# EAGLE design Simon_Tilts (EAGLE 6.5.0)
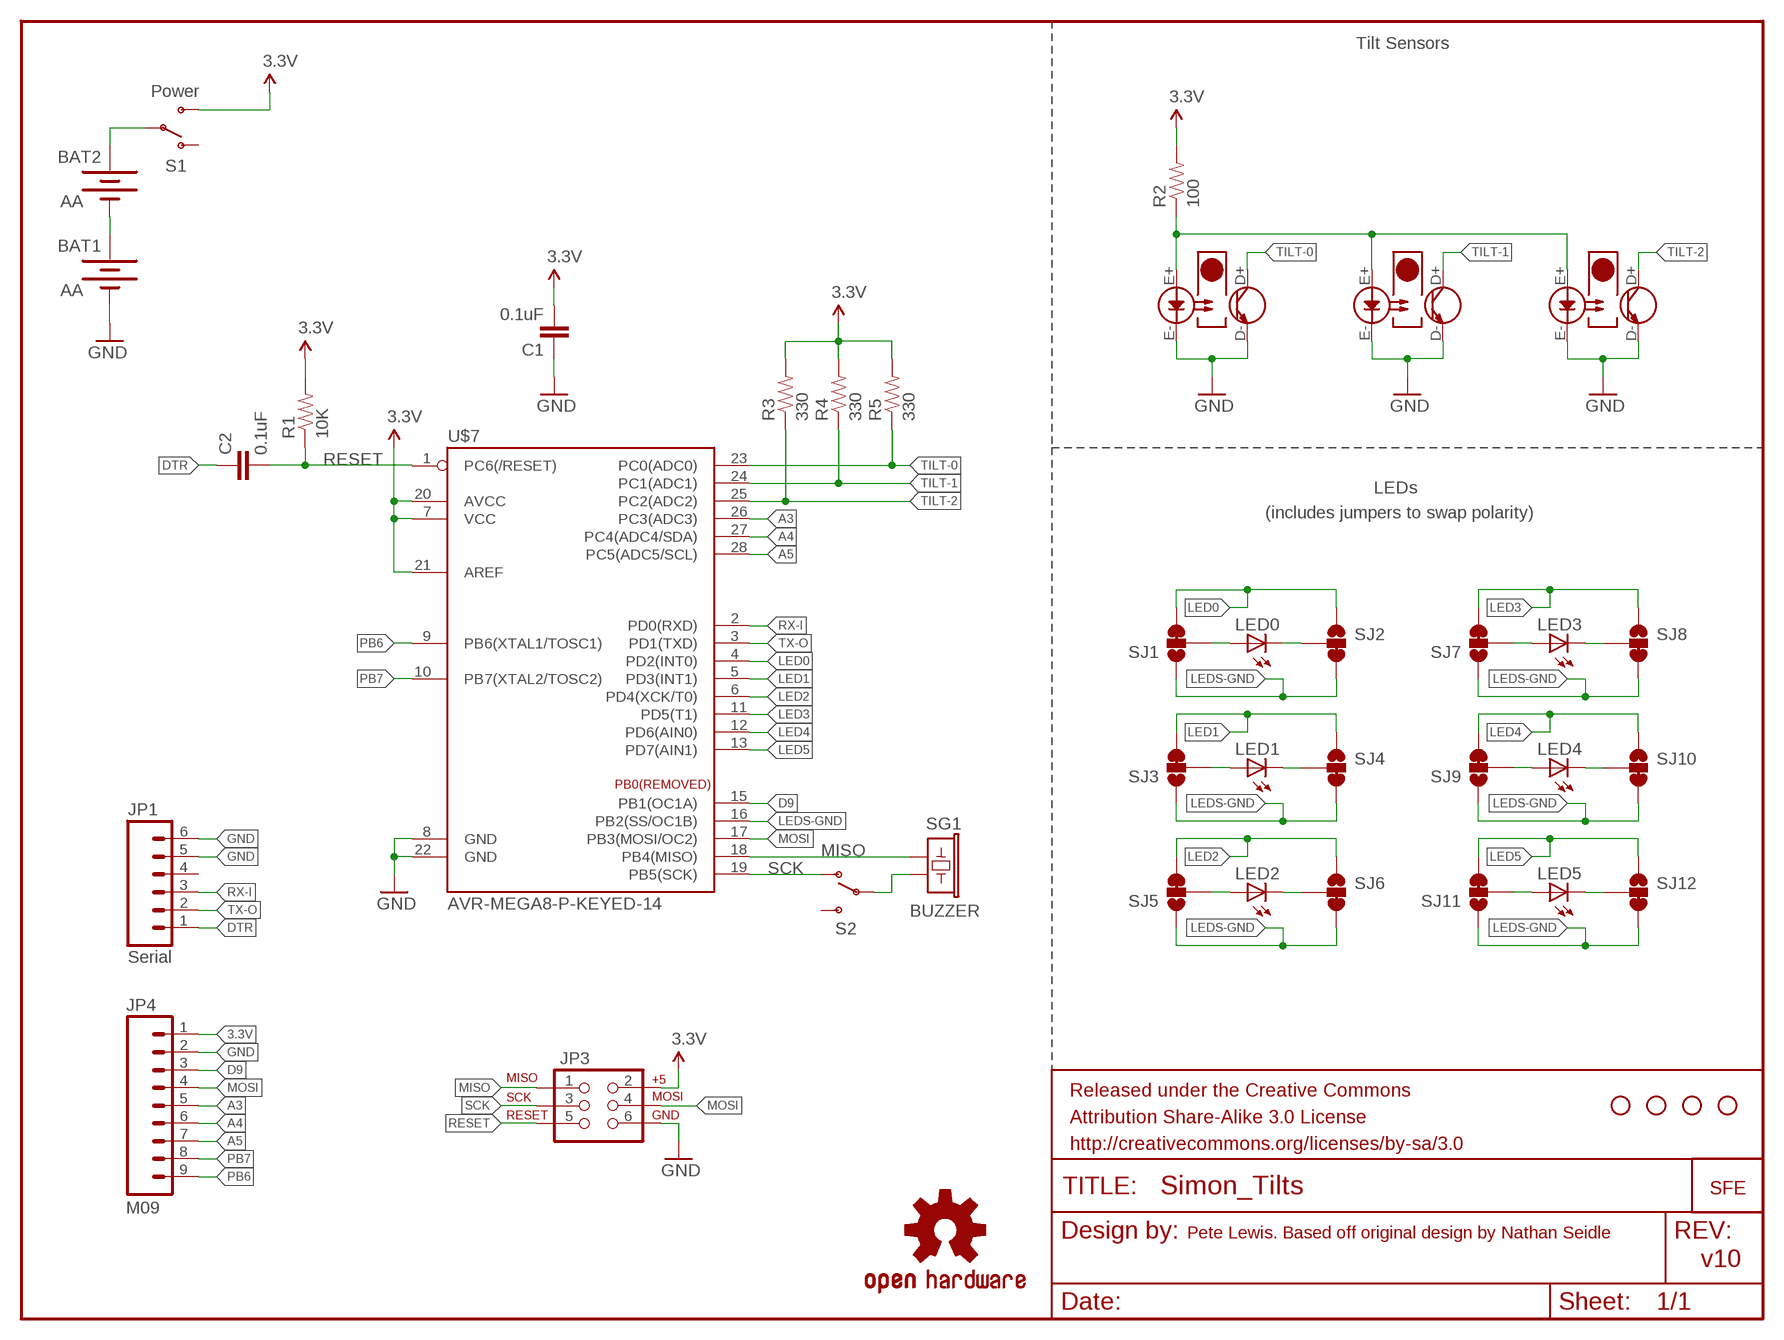
[diagram p0: schematic, sheet 1]

## Parts
BAT1  AA  BATTERYAA-KIT  [BATTERY-AA-KIT]
BAT2  AA  BATTERYAA-KIT  [BATTERY-AA-KIT]
C1  0.1uF  0.1UF-50V-20%(PTH)KIT-EZ  [CAP-PTH-SMALL-KIT]
C2  0.1uF  0.1UF-50V-20%(PTH)KIT-EZ  [CAP-PTH-SMALL-KIT]
FRAME1  FRAME-LETTER  [CREATIVE_COMMONS]
JP1  Serial  M06-SFENOSILK  [1X06-NOSILK]
JP2  STAND-OFF  [STAND-OFF]
JP3  AVR_SPI_PRG_6NS  [2X3-NS]
JP4  M09  [1X09]
JP5  STAND-OFF  [STAND-OFF]
JP6  STAND-OFF  [STAND-OFF]
JP7  STAND-OFF  [STAND-OFF]
LED0  LED5MM-KIT  [LED5MM-KIT]
LED1  LED5MM-KIT  [LED5MM-KIT]
LED2  LED5MM-KIT  [LED5MM-KIT]
LED3  LED5MM-KIT  [LED5MM-KIT]
LED4  LED5MM-KIT  [LED5MM-KIT]
LED5  LED5MM-KIT  [LED5MM-KIT]
R1  10K  10KOHM1/6W5%(PTH)KIT  [AXIAL-0.3-KIT]
R2  100  RESISTORAX-0.3-KIT  [AXIAL-0.3-KIT]
R3  330  RESISTORAX-0.3-KIT  [AXIAL-0.3-KIT]
R4  330  RESISTORAX-0.3-KIT  [AXIAL-0.3-KIT]
R5  330  RESISTORAX-0.3-KIT  [AXIAL-0.3-KIT]
S1  Power  SWITCH-SPDTKIT  [SWITCH-SPDT_KIT]
S2  SWITCH-SPDTKIT  [SWITCH-SPDT_KIT]
SG1  BUZZER  BUZZERPTH-KIT  [BUZZER-12MM-KIT]
SJ1  SOLDERJUMPER_2WAYS  [SJ_3]
SJ2  SOLDERJUMPER_2WAYS  [SJ_3]
SJ3  SOLDERJUMPER_2WAYS  [SJ_3]
SJ4  SOLDERJUMPER_2WAYS  [SJ_3]
SJ5  SOLDERJUMPER_2WAYS  [SJ_3]
SJ6  SOLDERJUMPER_2WAYS  [SJ_3]
SJ7  SOLDERJUMPER_2WAYS  [SJ_3]
SJ8  SOLDERJUMPER_2WAYS  [SJ_3]
SJ9  SOLDERJUMPER_2WAYS  [SJ_3]
SJ10  SOLDERJUMPER_2WAYS  [SJ_3]
SJ11  SOLDERJUMPER_2WAYS  [SJ_3]
SJ12  SOLDERJUMPER_2WAYS  [SJ_3]
U$1  LOGO-SFENEW  [SFE-NEW-WEBLOGO]
U$3  OSHW-LOGOS  [OSHW-LOGO-S]
U$4  TILT_SENSORV5  [TILT_SENSOR_V5]
U$5  TILT_SENSORV5  [TILT_SENSOR_V5]
U$6  TILT_SENSORV5  [TILT_SENSOR_V5]
U$7  AVR-MEGA8-P-KEYED-14  [DIL28-3_KEYED-14]

## Nets
3.3V: C1.2 JP3.2 JP4.1 R1.P$2 R2.P$2 R3.P$2 R4.P$2 R5.P$2 S1.3(S) U$7.7(VCC) U$7.20(AVCC) U$7.21(AREF)
A3: JP4.5 U$7.26(PC3(ADC3))
A4: JP4.6 U$7.27(PC4(ADC4/SDA))
A5: JP4.7 U$7.28(PC5(ADC5/SCL))
D9: JP4.3 U$7.15(PB1(OC1A))
DTR: C2.1 JP1.1
GND: BAT1.GND@1(-) C1.1 JP1.5 JP1.6 JP3.6 JP4.2 U$4.D- U$4.E- U$5.D- U$5.E- U$6.D- U$6.E- U$7.8(GND) U$7.22(GND)
LED0: SJ1.3 SJ2.1 U$7.4(PD2(INT0))
LED1: SJ3.3 SJ4.1 U$7.5(PD3(INT1))
LED2: SJ5.3 SJ6.1 U$7.6(PD4(XCK/T0))
LED3: SJ7.3 SJ8.1 U$7.11(PD5(T1))
LED4: SJ9.3 SJ10.1 U$7.12(PD6(AIN0))
LED5: SJ11.3 SJ12.1 U$7.13(PD7(AIN1))
LEDS-GND: SJ1.1 SJ2.3 SJ3.1 SJ4.3 SJ5.1 SJ6.3 SJ7.1 SJ8.3 SJ9.1 SJ10.3 SJ11.1 SJ12.3 U$7.16(PB2(SS/OC1B))
MISO [ButtonSignal]: JP3.1 SG1.+ U$7.18(PB4(MISO))
MOSI: JP3.4 JP4.4 U$7.17(PB3(MOSI/OC2))
N$1: LED0.A SJ1.2
N$2: BAT2.PWR@1(+) S1.2(P)
N$3: S2.2(P) SG1.-
N$4: BAT1.PWR@1(+) BAT2.GND@1(-)
N$6: R2.P$1 U$4.E+ U$5.E+ U$6.E+
N$7: LED0.K(C) SJ2.2
N$8: LED1.A SJ3.2
N$9: LED1.K(C) SJ4.2
N$10: LED2.A SJ5.2
N$11: LED2.K(C) SJ6.2
N$12: LED3.A SJ7.2
N$13: LED3.K(C) SJ8.2
N$14: LED4.A SJ9.2
N$15: LED4.K(C) SJ10.2
N$16: LED5.A SJ11.2
N$17: LED5.K(C) SJ12.2
PB6: JP4.9 U$7.9(PB6(XTAL1/TOSC1))
PB7: JP4.8 U$7.10(PB7(XTAL2/TOSC2))
RESET: C2.2 JP3.5 R1.P$1 U$7.1(PC6(/RESET))
RX-I: JP1.3 U$7.2(PD0(RXD))
SCK: JP3.3 S2.1(O) U$7.19(PB5(SCK))
TILT-0: R5.P$1 U$4.D+ U$7.23(PC0(ADC0))
TILT-1: R4.P$1 U$5.D+ U$7.24(PC1(ADC1))
TILT-2: R3.P$1 U$6.D+ U$7.25(PC2(ADC2))
TX-O: JP1.2 U$7.3(PD1(TXD))
Unconnected: JP1.4 S1.1(O) S2.3(S)

## Notes on the sheet
- Tilt Sensors
- LEDs
- (includes jumpers to swap polarity)
- Pete Lewis. Based off original design by Nathan Seidle
- v10

## Library data of the parts
BAT1 BAT2 = SparkFun-Electromechanical:BATTERY: Battery Holders Various common sizes : AA, AAA, 20mm coin cell and 12mm coin cell. 20MM_4LEGS, BATT-10373; PROD_ID: BATT-08316
C1 C2 = SparkFun-Capacitors:0.1UF-50V-20%(PTH): CAP-08370; PROD_ID: CAP-08370
FRAME1 = SparkFun-Aesthetics:FRAME-LETTER: Schematic Frame Standard 8.5x11 US Letter frame
JP1 = unclepetes:M06-SFE: Header 6 Standard 6-pin 0.1" header. Use with straight break away headers (SKU : PRT-00116), right angle break away headers (PRT-00553), swiss pins (PRT-00743), machine pins (PRT-00117), and female headers (PRT-00115). Molex polarized connector foot print use with SKU : PRT-08094 with associated crimp pins and housings. NOTES ON THE VARIANTS LOCK and LOCK_LONGPADS... This footprint was designed to help hold the alignment of a through-hole component (i.e. 6-pin header) while soldering it into place. You may notice that each hole has been shifted either up or down by 0.005 of an inch from it's more standard position (which is a perfectly straight line). This slight alteration caused the pins (the squares in the middle) to touch the edges of the holes. Because they are alternating, it causes a "brace" to hold the component in place. 0.005 has proven to be the perfect amount of "off-center" position when using our standard breakaway headers. Although looks a little odd when you look at the bare footprint, once you have a header in there, the alteration is very hard to notice. Also, if you push a header all the way into place, it is covered up entirely on the bottom side. This idea of altering the position of holes to aid alignment will be further integrated into the Sparkfun Library for other footprints. It can help hold any component with 3 or more connection pins.
JP2 JP5-JP7 = SparkFun:STAND-OFF: Stand Off This is the mechanical footprint for a #4 phillips button head screw. Use the keepout ring to avoid running the screw head into surrounding components. SKU : PRT-00447
JP3 = SparkFun:AVR_SPI_PRG_6: AVR ISP 6 Pin This is the reduced ISP connector for AVR programming. Common on Arduino. This footprint will take up less PCB space and can be used with a 10-pin to 6-pin adapter such as SKU: BOB-08508
JP4 = SparkFun-Connectors:M09: Header 9 Standard 9-pin 0.1" header. Use with straight break away headers (SKU : PRT-00116), right angle break away headers (PRT-00553), swiss pins (PRT-00743), machine pins (PRT-00117), and female headers (PRT-00115).
LED0 LED1-LED5 = SparkFun:LED: LEDs Standard schematic elements and footprints for 5mm, 3mm, 1206, and 0603 sized LEDs. 5mm - Spark Fun Electronics SKU : COM-00529 (and others)
R1 = SparkFun-Resistors:10KOHM1/6W5%(PTH): RES-08375; PROD_ID: RES-08375
R2-R5 = Testing:RESISTOR: Resistor Basic schematic elements and footprints for 0603, 1206, and PTH resistors.
S1 S2 = SparkFun-Electromechanical:SWITCH-SPDT: SPDT Switch Simple slide switch, Spark Fun Electronics SKU : COM-00102 DPDT SMT slide switch, AYZ0202, SWCH-08179; PROD_ID: SWCH-08261
SG1 = SparkFun-Electromechanical:BUZZER: Buzzer 12mm Spark Fun Electronics SKU : Comp-Buzzer; PROD_ID: COMP-08253
SJ1-SJ12 = SparkFun-Passives:SOLDERJUMPER_2WAY: Solder Jumper 2 way solder jumper
U$1 = SparkFun:LOGO-SFE: Spark Fun Electronics PCB Logo This is the standard Spark Fun Electronics PCB logo.
U$3 = SparkFun:OSHW-LOGO: Open Source Hardware Logo This logo indicates the piece of hardware it is found on incorporates a OSHW license and/or adheres to the definition of open source hardware found here: http://freedomdefined.org/OSHW
U$4-U$6 = Testing:TILT_SENSOR
U$7 = Testing:AVR-MEGA8-P-KEYED-14

## Net classes
0 Default: width 0.254 mm
1 Power: width 0.254 mm
3 ButtonSignal: width 0.254 mm

## Board
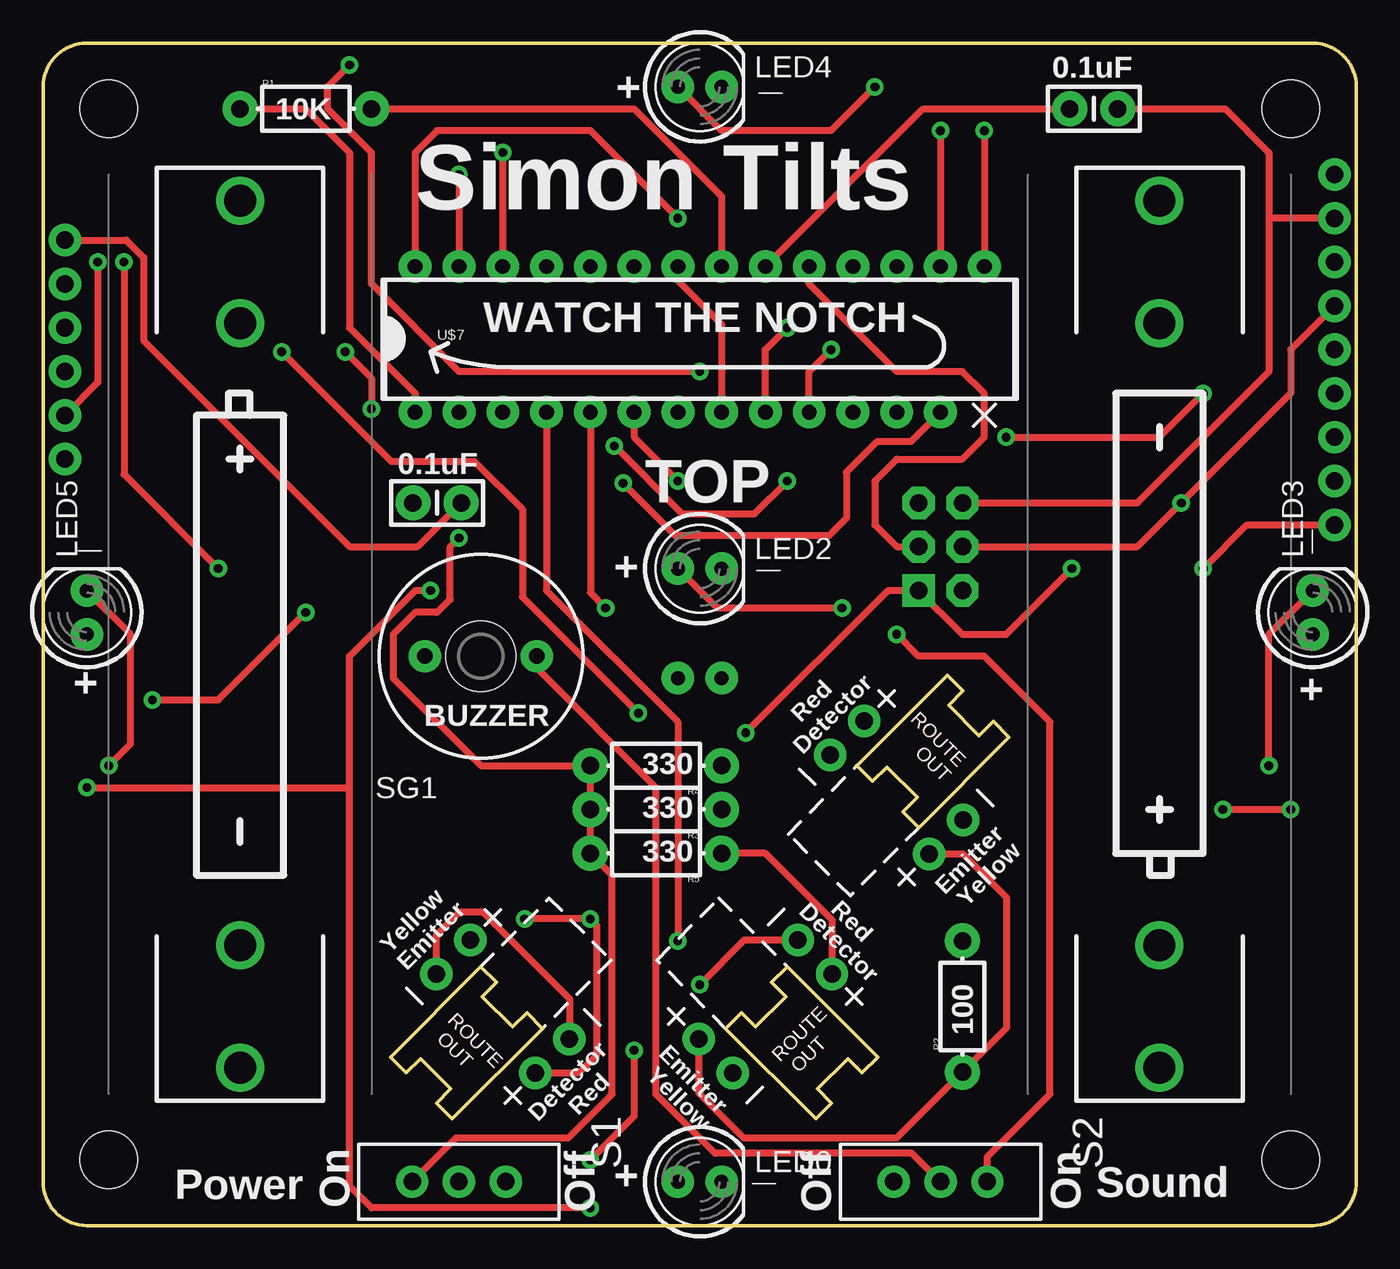
[diagram p1: board, top side]
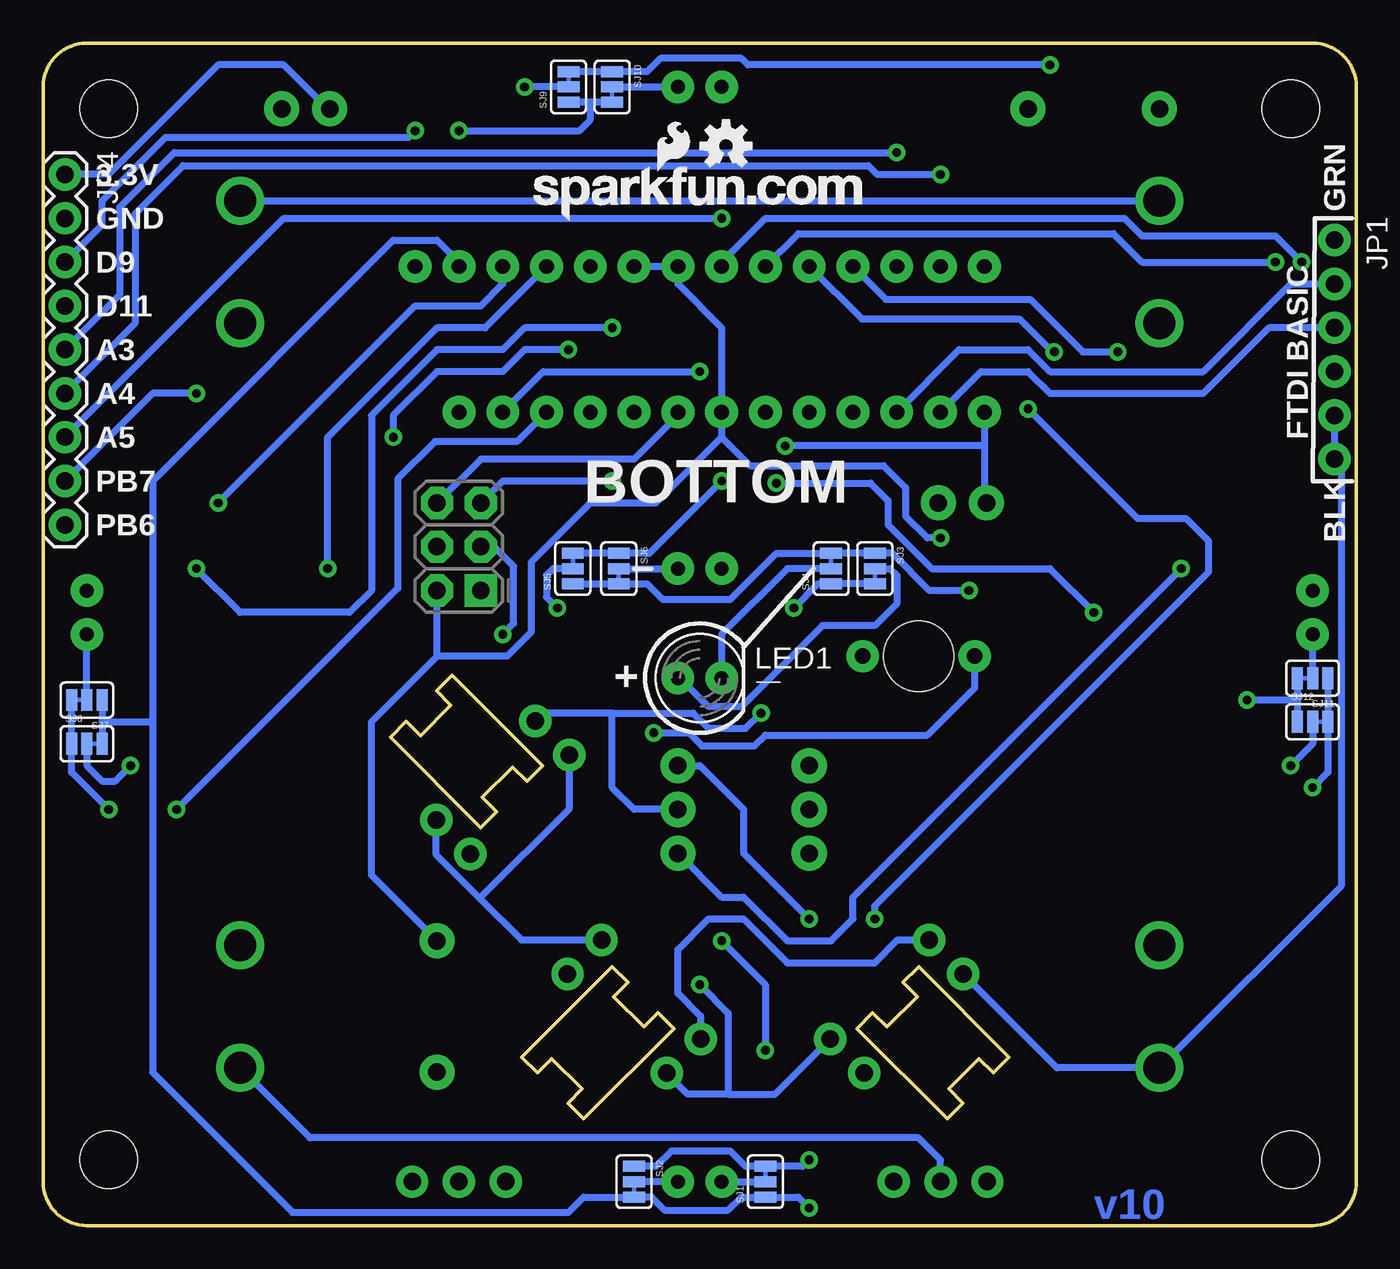
[diagram p2: board, bottom side, seen from below]

Size 76.2 x 68.58 mm. Coordinates in mm from the lower left corner, seen from the top.
Outline: 2.54,0 arc-90 0,2.54 0,66.04 arc-90 2.54,68.58 73.66,68.58 arc-90 76.2,66.04 76.2,2.54 arc-90 73.66,0 2.54,0
Copper layers (1*16): Top 0.035mm / dielectric 1.5mm / Bottom 0.035mm
Design rules "SparkFun *": minimum track width 10mil, minimum drill 20mil, track to track 8mil, track to pad 8mil, pad to pad 8mil, via to via 8mil, smd to smd 8mil, copper to edge 10mil, drill to drill 8mil, minimum pad ring 12mil, minimum via ring 10mil, stop-mask expansion 4mil, vias tented up to drill 25mil, thermal gap 10mil
Holes 4.06 mm at 25.4,33.02

### Footprints (pad centres in the part's own frame; a part is rotated, then mirrored left to right if it is on the bottom)
BATTERY-AA-KIT = drill 1.854: GND@1 25.146,0; GND@2 18.034,0; PWR@1 -25.146,0; PWR@2 -18.034,0
CAP-PTH-SMALL-KIT = drill 1.016 pad 2.032: 1 -1.397,0; 2 1.397,0
1X06-NOSILK = drill 1.016 pad 1.88: 1 0,0; 2 2.54,0; 3 5.08,0; 4 7.62,0; 5 10.16,0; 6 12.7,0
STAND-OFF = hole 3.302: 0,0
2X3-NS = drill 1.016 pad 1.88 square: 1 -2.54,-1.27 | drill 1.016 pad 1.88 octagon: 2 -2.54,1.27; 3 0,-1.27; 4 0,1.27; 5 2.54,-1.27; 6 2.54,1.27
1X09 = drill 1.016 pad 1.88: 1 0,0; 2 2.54,0; 3 5.08,0; 4 7.62,0; 5 10.16,0; 6 12.7,0; 7 15.24,0; 8 17.78,0; 9 20.32,0
LED5MM-KIT = drill 0.813 pad 1.88: A -1.27,0; K 1.27,0
AXIAL-0.3-KIT = drill 1.016 pad 2.032: P$1 -3.81,0; P$2 3.81,0
SWITCH-SPDT_KIT = drill 1.016 pad 1.88: 1 0,2.718; 2 0,0; 3 0,-2.718
BUZZER-12MM-KIT = drill 0.9 pad 1.88: + 3.25,0; - -3.25,0
SJ_3 = smd 0.635 x 1.27: 1 -0.889,0; 2 0,0; 3 0.889,0
TILT_SENSOR_V5 = drill 1.016 pad 1.88: D+ 4.064,-1.397; D- 4.064,1.397; E+ -4.064,1.397; E- -4.064,-1.397
DIL28-3_KEYED-14 = drill 0.864 pad 1.905: 1 -16.51,-4.255; 2 -13.97,-4.255; 3 -11.43,-4.255; 4 -8.89,-4.255; 5 -6.35,-4.255; 6 -3.81,-4.255; 7 -1.27,-4.255; 8 1.27,-4.255; 9 3.81,-4.255; 10 6.35,-4.255; 11 8.89,-4.255; 12 11.43,-4.255; 13 13.97,-4.255; 15 16.51,4.191; 16 13.97,4.191; 17 11.43,4.191; 18 8.89,4.191; 19 6.35,4.191; 20 3.81,4.191; 21 1.27,4.191; 22 -1.27,4.191; 23 -3.81,4.191; 24 -6.35,4.191; 25 -8.89,4.191; 26 -11.43,4.191; 27 -13.97,4.191; 28 -16.51,4.191

### Placement (x,y rotation side)
BAT1  11.43,34.29 270 top
BAT2  64.77,34.29 90 top
C1  60.96,64.77 180 top
C2  22.86,41.91 180 top
FRAME1  8.54,-8.89 0 top  (outside the outline)
JP1  1.27,57.15 270 bottom
JP2  72.39,3.81 0 top
JP3  52.07,39.37 90 bottom
JP4  74.93,60.96 270 bottom
JP5  3.81,64.77 0 top
JP6  72.39,64.77 0 top
JP7  3.81,3.81 0 top
LED0  38.1,2.54 0 top
LED1  38.1,31.75 0 bottom
LED2  38.1,38.1 0 top
LED3  73.66,35.56 90 top
LED4  38.1,66.04 0 top
LED5  2.54,35.56 90 top
R1  15.24,64.77 0 top
R2  53.34,12.7 90 top
R3  35.56,24.13 180 top
R4  35.56,26.67 180 top
R5  35.56,21.59 180 top
S1  24.13,2.54 270 top
S2  52.07,2.54 270 top
SG1  25.4,33.02 180 top
SJ1  34.29,2.54 90 bottom
SJ2  41.91,2.54 270 bottom
SJ3  27.94,38.1 270 bottom
SJ4  30.48,38.1 90 bottom
SJ5  45.47,38.1 90 bottom
SJ6  42.8,38.1 270 bottom
SJ7  73.66,30.48 180 bottom
SJ8  73.66,27.94 0 bottom
SJ9  45.72,66.04 90 bottom
SJ10  43.18,66.04 270 bottom
SJ11  2.54,31.75 180 bottom
SJ12  2.54,29.21 0 bottom
U$1  47.75,58.29 0 bottom
U$3  36.58,62.61 0 bottom
U$4  41.91,12.7 45 top
U$5  26.67,12.7 315 top
U$6  49.53,25.4 135 top
U$7  38.1,51.44 0 top

### Tracks (layer width: path | path; a pad name or v marks a point on that pad's centre or on a via)
3.3V  (via drill 0.51)
  Top 0.406: R1.P$2 34.29,64.77 39.37,59.69 U$7.21 | U$7.20 51.05,64.77 C1.2 | S1.3 23.95,5.08 30.48,5.08 33.02,7.62 33.02,20.32 R5.P$2 R3.P$2 R4.P$2 25.4,26.67 20.32,31.75 20.32,34.29 21.59,35.56 22.86,35.56 23.62,36.32 23.62,39.37 v24.13,39.88
  Bottom 0.406: U$7.20 U$7.21 39.37,54.61 36.83,52.07 U$7.7 36.83,45.72 | 53.34,35.56 JP3.2 53.34,33.02 | C1.2 59.69,64.77 62.23,67.31 66.04,67.31 72.39,60.96 JP4.1 | R2.P$2 57.15,20.32 57.15,29.21 53.34,33.02 | 53.34,33.02 49.28,33.02 47.88,34.42 47.88,38.48 44.45,41.91 40.64,41.91 36.83,45.72 | 36.83,45.72 35.18,44.07 27.43,44.07 26.16,42.8 26.16,41.15 24.89,39.88 v24.13,39.88
A3  (via drill 0.51)
  Top 0.406: v26.67,62.23 U$7.26
  Bottom 0.406: JP4.5 71.75,53.98 71.75,59.05 68.58,62.23 v26.67,62.23
A4  (via drill 0.51)
  Top 0.406: v24.13,60.96 U$7.27
  Bottom 0.406: JP4.6 70.87,52.32 70.87,58.67 68.07,61.47 28.32,61.47 27.81,60.96 v24.13,60.96
A5  (via drill 0.51)
  Top 0.406: v36.83,58.42 31.75,63.5 22.86,63.5 21.59,62.23 U$7.28
  Bottom 0.406: JP4.7 62.23,58.42 v36.83,58.42
D9  (via drill 0.51)
  Top 0.406: v54.61,63.5 U$7.15
  Bottom 0.406: JP4.3 72.77,58.04 72.77,59.44 69.09,63.12 54.99,63.12 v54.61,63.5
DTR
  Top 0.406: C2.1 21.72,39.37 17.78,39.37 5.84,51.31 5.84,56.13 4.83,57.15 JP1.1
GND  (via drill 0.51)
  Top 0.406: U$7.8 39.37,52.26 36.83,54.8 U$7.22 | C1.1 68.58,64.77 71.12,62.23 71.12,58.42 | 71.12,58.42 71.12,49.53 63.5,41.91 JP3.6 | v3.17,55.88 3.17,48.9 JP1.5 | JP4.2 71.12,58.42 | v38.1,13.97 40.69,16.56 U$4.D- | U$5.E- 22.81,16.84 24.13,18.16 25.53,18.16 30.53,13.16 U$5.D-
  Bottom 0.406: JP1.5 JP1.6 0.89,44.07 0.89,19.68 BAT1.GND@1 17.37,9.14 U$5.E- | U$7.8 39.37,46.99 41.91,44.45 50.8,44.45 JP3.6 | U$7.22 36.83,55.88 34.29,58.42 13.46,58.42 12.45,57.4 4.7,57.4 v3.17,55.88 | v38.1,13.97 36.45,12.32 36.45,7.62 | 50.86,18.99 45.67,24.18 U$6.D- | 36.45,7.62 33.73,7.62 U$5.D- | 36.45,7.62 38.81,7.62 U$4.E- | 50.86,18.99 48.44,16.56 U$4.D- | 50.86,18.99 53.39,21.52 U$6.E-
LED0  (via drill 0.51)
  Top 0.406: U$7.4 29.21,36.83 36.83,29.21 v36.83,16.51 | v34.29,10.16 34.29,6.35 v31.75,3.81
  Bottom 0.406: v36.83,16.51 34.29,13.97 v34.29,10.16 | v31.75,3.81 32.13,3.43 SJ1.3 35.43,3.43 36.32,4.32 39.75,4.32 40.64,3.43 SJ2.1
LED1  (via drill 0.51)
  Top 0.406: U$7.5 31.75,36.7 v32.64,35.81
  Bottom 0.406: SJ3.3 SJ4.1 31.24,37.21 v32.64,35.81
LED2  (via drill 0.51)
  Top 0.406: U$7.6 34.29,45.72 v36.83,43.18
  Bottom 0.406: v36.83,43.18 41.02,38.99 SJ6.1 SJ5.3
LED3  (via drill 0.51)
  Top 0.406: v68.45,24.13 v72.39,24.13
  Bottom 0.406: U$7.11 48.7,45.47 53.47,45.47 55.63,43.31 55.63,36.96 v68.45,24.13 | v72.39,24.13 74.55,26.29 SJ8.1 SJ7.3
LED4  (via drill 0.51)
  Top 0.406: v38.1,49.53 24.13,49.53 19.05,54.61 19.05,62.23 16.51,64.77 16.51,66.04 v17.78,67.31
  Bottom 0.406: U$7.12 47.18,49.53 v38.1,49.53 | SJ10.1 SJ9.3 41.15,66.93 40.39,67.69 35.69,67.69 35.31,67.31 v17.78,67.31
LED5  (via drill 0.51)
  Top 0.406: U$7.13 50.35,45.47 48.39,45.47 46.61,43.69 46.61,41.02 45.59,40.01 36.7,40.01 v33.66,43.05 | v6.35,30.48 10.16,30.48 v15.24,35.56
  Bottom 0.406: v15.24,35.56 17.78,38.1 24.64,38.1 27.18,40.64 27.18,42.04 28.19,43.05 v33.66,43.05 | SJ11.3 3.43,30.48 | 3.43,30.48 SJ12.1 | v6.35,30.48 3.43,30.48
LEDS-GND  (via drill 0.51)
  Top 0.406: v52.07,63.5 U$7.16 | v31.75,1.02 19.05,1.02 17.78,2.29 17.78,25.4 | 17.78,25.4 17.78,33.02 21.59,36.83 v22.48,36.83 | v2.54,25.4 17.78,25.4
  Bottom 0.406: 69.85,29.21 69.85,43.18 55.88,57.15 53.34,57.15 52.07,55.88 U$7.16 | 69.85,29.21 69.85,8.89 61.72,0.76 45.72,0.76 44.83,1.65 SJ2.3 40.89,1.65 40.13,0.89 36.45,0.89 35.69,1.65 SJ1.1 32.38,1.65 v31.75,1.02 | SJ8.3 SJ7.1 72.77,29.21 69.85,29.21 | SJ10.3 SJ9.1 44.45,65.15 44.45,64.14 45.09,63.5 v52.07,63.5 | SJ12.3 SJ11.1 1.65,26.29 v2.54,25.4 | v22.48,36.83 24.77,36.83 26.92,38.99 SJ3.1 SJ4.3 33.66,38.99 36.32,36.32 40.26,36.32 41.15,37.21 SJ6.3 SJ5.1
MISO  (via drill 0.51)
  Top 0.406: v59.69,38.1 55.88,34.29 53.34,34.29 JP3.1 49.02,36.83 v40.77,28.57
  Bottom 0.406: U$7.18 50.55,52.07 53.34,52.07 59.69,45.72 v59.69,38.1 | SG1.+ 22.15,31.19 24.89,28.45 34.29,28.45 34.92,27.81 37.97,27.81 38.73,28.57 v40.77,28.57
MOSI  (via drill 0.51)
  Top 0.406: JP3.4 63.5,39.37 v66.04,41.91 72.39,48.26 72.39,50.8 JP4.4
  Bottom 0.406: v66.04,41.91 54.61,53.34 50.8,53.34 49.53,54.61 U$7.17
N$1
  Bottom 0.406: LED0.A SJ1.2
N$2
  Bottom 0.406: S1.2 24.13,3.81 25.4,5.08 60.71,5.08 BAT2.PWR@1
N$3
  Top 0.406: S2.2 50.42,4.19 38.99,4.19 35.56,7.62 35.56,25.4 28.65,32.31 SG1.-
N$4
  Bottom 0.406: BAT2.GND@1 BAT1.PWR@1
N$5
  Bottom 0.254: 34.29,3.3 34.29,2.67
N$6
  Top 0.406: U$4.E+ 38.05,7.67 40.64,5.08 49.53,5.08 R2.P$1 55.88,11.43 55.88,19.05 53.39,21.54 U$6.E+
  Bottom 0.406: U$5.E+ 26.62,16.56 27.94,15.24 33.02,15.24 35.56,17.78 37.59,17.78 39.37,16 39.37,13.46 38.05,12.14 U$4.E+
N$7
  Bottom 0.254: SJ2.2 41.91,1.78
  Bottom 0.406: LED0.K SJ2.2
N$8
  Bottom 0.254: SJ3.2 27.94,37.34
  Bottom 0.406: SJ3.2 27.05,38.1 26.67,37.72 26.67,36.07 27.94,34.8 30.99,34.8 35.69,30.1 37.59,30.1 39.24,31.75 LED1.A
N$9
  Bottom 0.254: SJ4.2 30.48,38.86
  Bottom 0.406: 36.83,32.13 LED1.K 36.83,34.29 33.02,38.1 SJ4.2
N$10  (via drill 0.51)
  Top 0.406: v46.35,35.81 39.12,35.81 LED2.A
  Bottom 0.254: SJ5.2 45.47,38.86
  Bottom 0.406: SJ5.2 46.61,38.1 46.99,37.72 46.99,36.45 v46.35,35.81
N$11
  Bottom 0.254: SJ6.2 42.8,37.34
  Bottom 0.406: SJ6.2 LED2.K
N$12
  Bottom 0.254: SJ7.2 74.42,30.48
  Bottom 0.406: SJ7.2 LED3.A
N$13  (via drill 0.51)
  Top 0.406: v71.12,26.67 71.12,34.29 LED3.K
  Bottom 0.254: SJ8.2 72.9,27.94
  Bottom 0.406: SJ8.2 73.66,26.67 72.77,25.78 72.01,25.78 v71.12,26.67
N$14  (via drill 0.51)
  Top 0.406: v48.26,66.04 45.72,63.5 39.37,63.5 LED4.A
  Bottom 0.254: SJ9.2 45.72,66.8
  Bottom 0.406: SJ9.2 v48.26,66.04
N$15
  Bottom 0.254: SJ10.2 43.18,65.28
  Bottom 0.406: SJ10.2 LED4.K
N$16
  Bottom 0.254: SJ11.2 3.3,31.75
  Bottom 0.406: SJ11.2 LED5.A
N$17  (via drill 0.51)
  Top 0.406: v3.81,26.67 5.08,27.94 5.08,34.29 LED5.K
  Bottom 0.254: SJ12.2 1.78,29.21
  Bottom 0.406: SJ12.2 2.54,27.94 v3.81,26.67
PB6  (via drill 0.51)
  Top 0.406: U$7.9 41.91,50.8 v43.18,52.07 | v67.31,38.1 69.85,40.64 JP4.9
  Bottom 0.406: v43.18,52.07 48.26,52.07 49.53,50.8 53.34,50.8 57.15,46.99 57.15,36.83 58.42,35.56 64.77,35.56 v67.31,38.1
PB7  (via drill 0.51)
  Top 0.406: U$7.10 44.45,49.53 v45.72,50.8 | v55.88,45.72 64.77,45.72 v67.31,48.26
  Bottom 0.406: v45.72,50.8 48.26,50.8 49.53,49.53 53.34,49.53 55.88,46.99 v55.88,45.72 | v67.31,48.26 69.85,48.26 JP4.8
RESET  (via drill 0.51)
  Top 0.406: U$7.1 21.59,48.26 17.78,52.07 17.78,62.23 15.24,64.77 R1.P$1 | v33.15,45.21 37.08,41.27 41.27,41.27 v43.18,43.18
  Bottom 0.406: U$7.1 21.59,45.21 | 21.59,45.21 21.59,42.04 C2.2 | 21.59,45.21 v33.15,45.21 | v43.18,43.18 49.53,43.18 JP3.5
RX-I
  Bottom 0.406: JP1.3 5.08,52.07 8.89,48.26 17.78,48.26 19.05,49.53 21.78,49.53 U$7.2
SCK  (via drill 0.51)
  Top 0.406: JP3.3 49.53,39.37 48.26,40.64 48.26,43.18 49.53,44.45 53.34,44.45 54.61,45.72 54.61,48.26 53.34,49.53 49.53,49.53 44.45,54.61 U$7.19 | S2.1 54.79,3.99 58.42,7.62 58.42,29.21 54.61,33.02 50.8,33.02 v49.53,34.29
  Bottom 0.406: v49.53,34.29 48.9,34.92 48.9,38.23 50.04,39.37 JP3.3
TILT-0  (via drill 0.51)
  Top 0.406: v4.7,55.88 4.7,43.56 v10.16,38.1 | R5.P$1 41.91,21.59 45.77,17.73 U$4.D+
  Bottom 0.406: U$7.23 32.38,57.53 14.1,57.53 12.45,55.88 v4.7,55.88 | v10.16,38.1 29.21,19.05 29.21,17.78 30.48,16.51 33.02,16.51 35.56,19.05 36.83,19.05 R5.P$1
TILT-1  (via drill 0.51)
  Top 0.406: v17.53,50.67 19.05,49.15 v19.05,47.37 | v27.94,17.78 v31.75,17.78 32.13,17.4 32.13,9.91 31.06,8.84 U$5.D+
  Bottom 0.406: U$7.24 28.7,52.58 19.56,52.58 17.65,50.67 v17.53,50.67 | v19.05,47.37 12.7,41.02 9.91,41.02 8.57,39.69 8.57,37.91 27.94,18.54 v27.94,17.78 | R4.P$1 38.1,26.67 35.56,24.13 35.56,21.59 v31.75,17.78
TILT-2  (via drill 0.51)
  Top 0.406: v13.84,50.67 20.19,44.32 25.02,44.32 27.81,41.53 27.81,36.45 v34.54,29.72
  Bottom 0.406: U$7.25 27.3,53.72 18.92,53.72 15.88,50.67 v13.84,50.67 | R3.P$1 41.91,24.13 43.18,25.4 43.18,29.72 | 43.18,29.72 38.48,29.72 37.59,28.83 35.43,28.83 v34.54,29.72 | 43.18,29.72 47.19,29.72 U$6.D+
TX-O
  Bottom 0.406: U$7.3 23.05,50.8 19.05,50.8 17.78,49.53 8.89,49.53 3.81,54.61 JP1.2

### Text on the board
Bottom: v10
tPlace: 0.1uF | _ | + | Simon Tilts | WATCH THE NOTCH | 0.1uF | TOP | _ | _ | _ | + | + | + | BUZZER | _ | Power | + | Sound | On | Off | Off | On
bPlace: 3.3V | GRN | GND | D9 | D11 | A3 | A4 | FTDI BASIC | A5 | PB7 | BOTTOM | BLK | PB6 | _ | +
tValues: Clip | All thru hole components make joint on bottom
tDocu: Pete Lewis. / Based off original design by Nathan Seidle